# EAGLE design control_systemLayout (EAGLE 9.6.2)
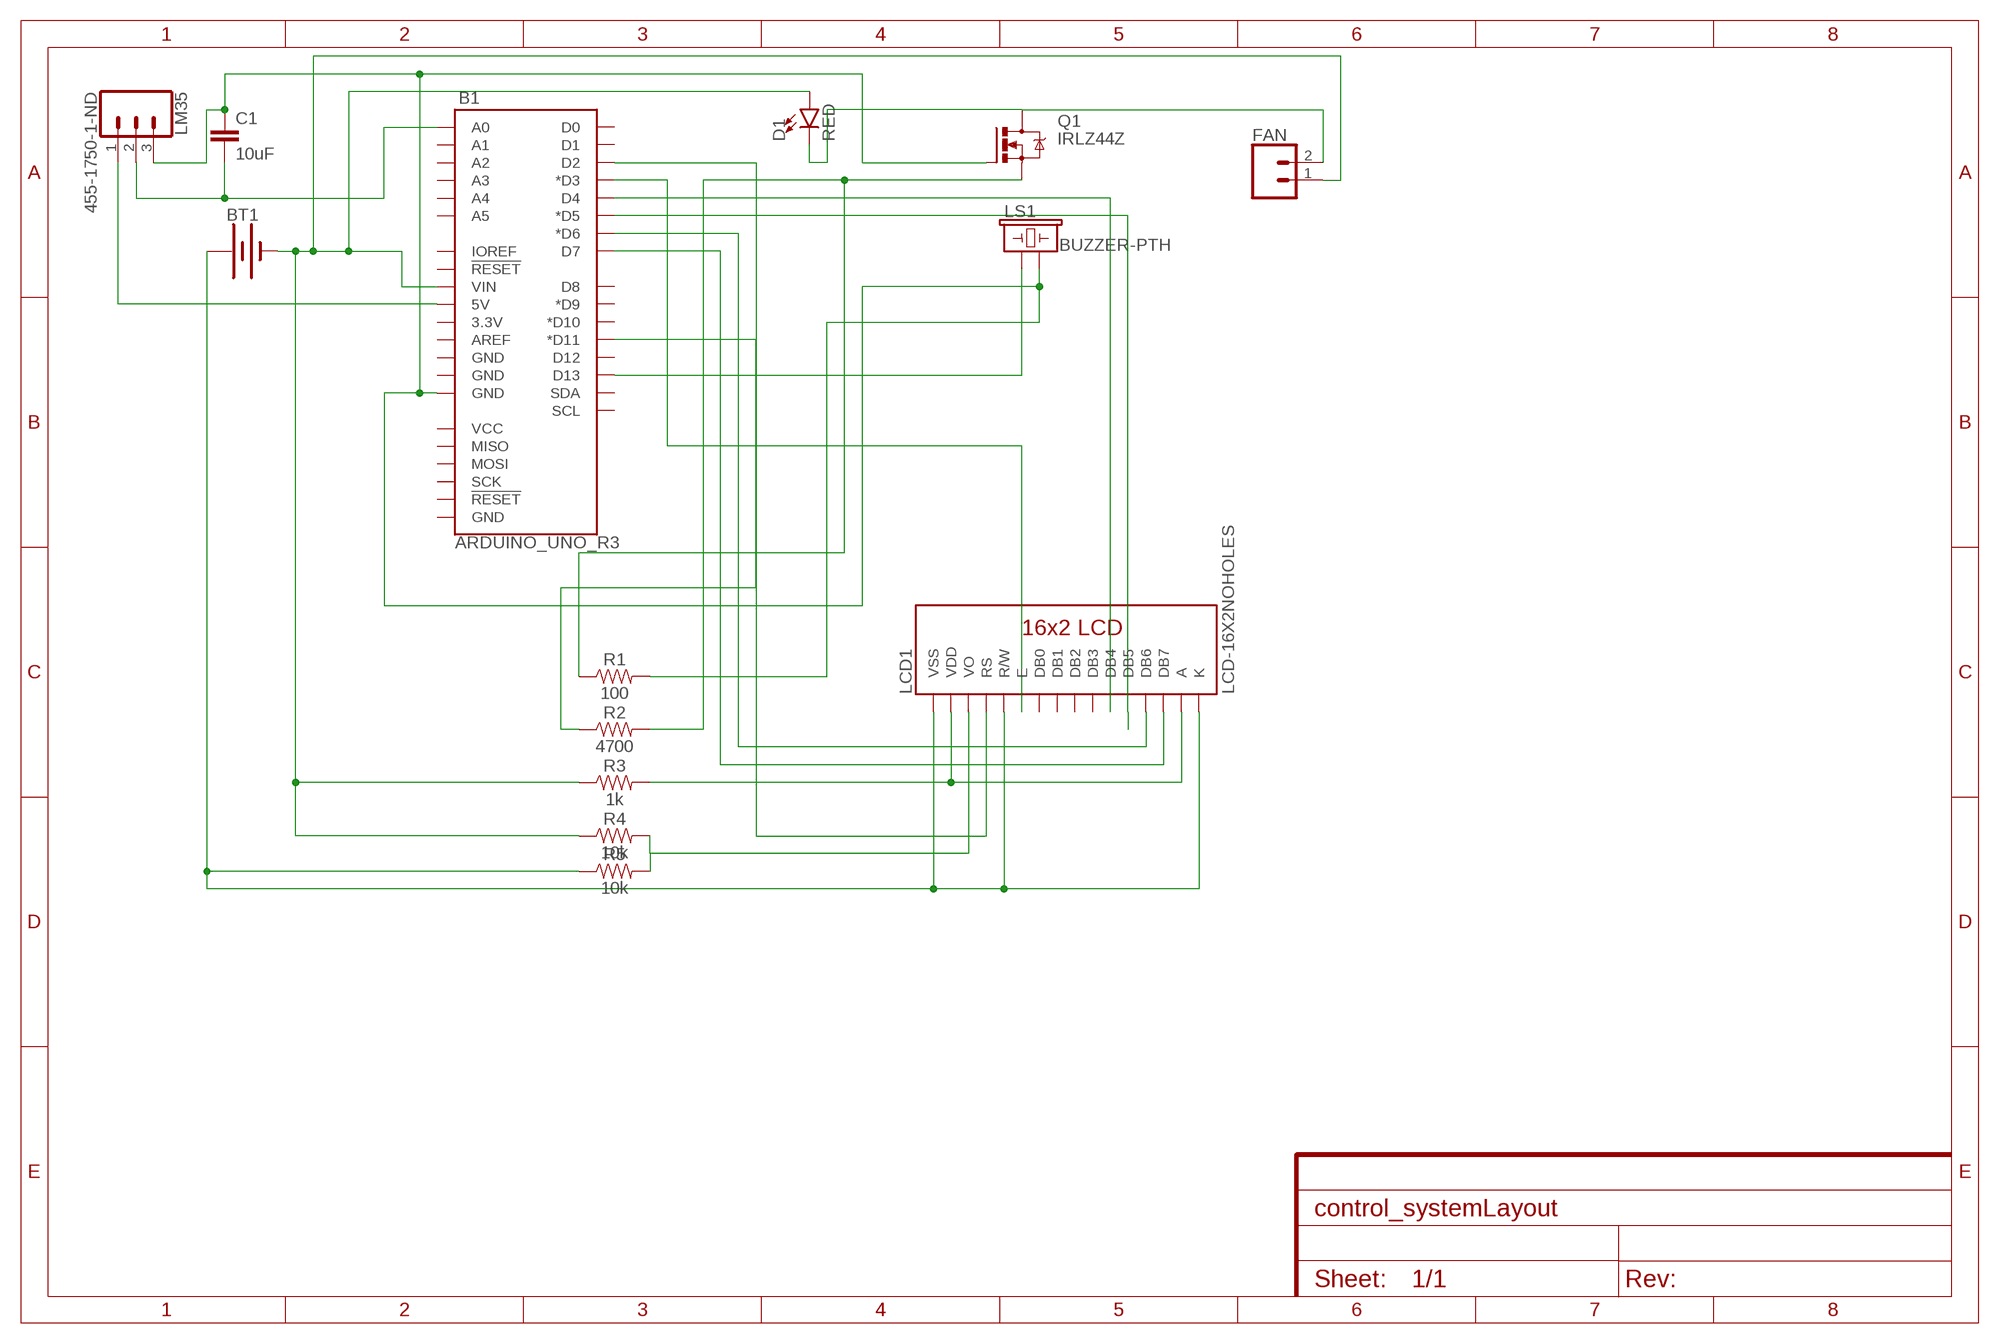
[diagram p0: schematic, sheet 1]

## Parts
B1  ARDUINO_UNO_R3  [ARDUINO_R3]
BT1  BATTERY-9V  [BATTCON_9V]
C1  10uF  0.18UF-0603-10V-10%  [0603]
D1  RED  LED-RED0603  [LED-0603]
FAN  CONN_02  [1X02]
LCD1  LCD-16X2NOHOLES  [LCD-16X2_NOHOLESNOSILK]
LM35  455-1750-1-ND  CONN_03  [1X03]
LS1  BUZZER-PTH  [BUZZER-12MM]
Q1  IRLZ44Z  [TO220BH]
R1  100  0.05OHM-0603-1/5W-1%  [0603]
R2  4700  0.05OHM-0603-1/5W-1%  [0603]
R3  1k  0.05OHM-0603-1/5W-1%  [0603]
R4  10k  0.05OHM-0603-1/5W-1%  [0603]
R5  10k  0.05OHM-0603-1/5W-1%  [0603]

## Nets
N$1: B1.VIN BT1.- D1.A FAN.1 R3.1 R4.1
N$2: B1.D13 LS1.+
N$3: Q1.S R1.1 R2.2
N$4: D1.C FAN.2 Q1.D
N$5: B1.D11(*D11) R2.1
N$6: LCD1.2(VDD) LCD1.15(A) R3.2
N$7: B1.GND@2(GND) C1.1 LM35.3 LS1.- Q1.G R1.2
N$8: B1.D7 LCD1.14(DB7)
N$9: BT1.+ LCD1.1(VSS) LCD1.5(R/W) LCD1.16(K) R5.1
N$10: B1.D6(*D6) LCD1.13(DB6)
N$11: B1.D5(*D5) LCD1.12(DB5)
N$12: B1.D4 LCD1.11(DB4)
N$13: B1.D3(*D3) LCD1.6(E)
N$14: B1.D2 LCD1.4(RS)
N$15: LCD1.3(VO) R4.2 R5.2
N$16: B1.5V LM35.1
N$17: B1.A0 C1.2 LM35.2
Unconnected: B1.3.3V B1.A1 B1.A2 B1.A3 B1.A4 B1.A5 B1.AREF B1.D0 B1.D1 B1.D8 B1.D9(*D9) B1.D10(*D10) B1.D12 B1.GND@1(GND) B1.GND@3(GND) B1.GND@4(GND) B1.IOREF B1.MISO B1.MOSI B1.RESET@1(!RESET!) B1.RESET@2(!RESET!) B1.SCK B1.SCL B1.SDA B1.VCC LCD1.7(DB0) LCD1.8(DB1) LCD1.9(DB2) LCD1.10(DB3)

## Library data of the parts
B1 = SparkFun-Boards:ARDUINO_UNO_R3: Arduino R3 Footprint with SPI header Arduino Uno R3 Compatible Footprint. Matches PCB size of the original board. SparkFun Products: SAMD21 Dev Breakout <https://www.sparkfun.com/products/13672> RedBoard <https://www.sparkfun.com/products/12757> R3 Stackable Headers <https://www.sparkfun.com/products/11417>
BT1 = SparkFun-Batteries:BATTERY: Battery - Single Cell A variety of battery chemistries, sizes, and footprints. Device List: 20MM_PTH - Coin Cell Battery Holder - 20mm (PTH) <https://www.sparkfun.com/products/783> 20MM_PTH_KIT- Coin Cell battery Holder - 20 mm (PTH) <http://www.sparkfun.com/products/783>kit version with special mask 6.8MM_PTH - Coin Cell Battery Holder - 6.8MM(SMD) <https://www.digikey.com/product-detail/en/seiko-instruments/MS621FE-FL11E/728-1057-ND/1889208?WT.srch=1&gclid=CNOQ5a6LzdQCFZS2wAodXCkE0g> 12MM_SMD - Coin Cell Battery Holder - 12mm (SMD) <https://www.sparkfun.com/products/10592> 12MM_PTH - Coin Cell Battery Holder - 12mm (PTH) <https://www.sparkfun.com/products/7948> 20MM_SMD - 20mm Coin Cell Battery Holder (SMD) (2 legs) Used on the Big Time Watch Kit <https://www.sparkfun.com/products/11734> 20MM_SMD_4LEGS - Coin Cell Battery Holder - 20mm (SMD) <https://www.sparkfun.com/products/11892> 20MM_SMD_4LEGS_OVERPASTE - Coin Cell Battery Holder - 20mm (SMD) <https://www.sparkfun.com/products/11892> (Over-paste on the legs) 24.5MM_PTH - Coin Cell Battery Holder - 24.5mm (PTH) <https://www.sparkfun.com/products/8863> 9V - 9V Battery Holder - PC Mount Used on the SparkFun SparkPunk Sound Kit <https://www.sparkfun.com/products/11177> and SparkFun SparkPunk Sequencer Kit <https://www.sparkfun.com/products/12707> 18650 - Battery Holder - 18650 (PTH) <https://www.sparkfun.com/products/13113> AA - Battery Holder - 1xAA (PTH) <https://www.sparkfun.com/products/7949> AAA - Battery Holder - 1xAAA (PTH) <https://www.sparkfun.com/products/12718> AA_KIT - Battery Holder - 1xAA (PTH) <https://www.sparkfun.com/products/7949> Special kit package - pads only have exposed copper on one side of the board. AAA_KIT - Battery Holder - 1xAAA (PTH) <https://www.sparkfun.com/products/12718> Special kit package - pads only have exposed copper on one side of the board.; PROD_ID: BATT-10855
C1 = SparkFun-Capacitors:0.18UF: 0.18µF ceramic capacitor A capacitor is a passive two-terminal electrical component used to store electrical energy temporarily in an electric field.; PROD_ID: CAP-12380; VALUE: 0.18uF
D1 = SparkFun-LED:LED-RED: Red SMD LED Used in manufacturing of most products at SparkFun Packages: 0603 - SMD 0603 package [Product Link] <http://docs.avagotech.com/docs/AV02-0551EN> 0603 SMART - SMD 0603 SMART package ( more efficient and expensive)[Product Link] <http://www.osram-os.com/Graphics/XPic2/00077099_0.pdf> 1206 - SMD1206 package [Product Link] <https://www.sparkfun.com/datasheets/DevTools/LilyPad/Q150OVS4.pdff> SparkFun Products: Pro Mini 328 -5V <https://www.sparkfun.com/products/821> RedBoard <https://www.sparkfun.com/products/12757> IOIO-OTG <https://www.sparkfun.com/products/13613>; PROD_ID: DIO-00819
FAN = SparkFun-Connectors:CONN_02: Multi connection point. Often used as Generic Header-pin footprint for 0.1 inch spaced/style header connections On any of the 0.1 inch spaced packages, you can populate with these: Break Away Headers - Straight <https://www.sparkfun.com/products/116> (PRT-00116) Break Away Male Headers - Right Angle <https://www.sparkfun.com/products/553> (PRT-00553) Female Headers <https://www.sparkfun.com/products/115> (PRT-00115) Break Away Headers - Machine Pin <https://www.sparkfun.com/products/117> (PRT-00117) Break Away Female Headers - Swiss Machine Pin <https://www.sparkfun.com/products/743> (PRT-00743) For SCREWTERMINALS and SPRING TERMINALS visit here: Screw Terimnals on SparkFun.com <https://www.sparkfun.com/search/results?term=Screw+Terminals> (5mm/3.5mm/2.54mm spacing) This device is also useful as a general connection point to wire up your design to another part of your project. Our various solder wires solder well into these plated through hole pads. Hook-Up Wire - Assortment (Stranded, 22 AWG) <https://www.sparkfun.com/products/11375> (PRT-11375) Hook-Up Wire - Assortment (Solid Core, 22 AWG) <https://www.sparkfun.com/products/11367> (PRT-11367) View the entire wire category on our website here <https://www.sparkfun.com/categories/141> Special notes: Molex polarized connector foot print use with: PRT-08233 with associated crimp pins and housings. 2.54_SCREWTERM for use with PRT-10571. 3.5mm Screw Terminal footprints for PRT-08084 5mm Screw Terminal footprints for use with PRT-08432
LCD1 = SparkFun-Displays:LCD-16X2: Standard text-only 16x2 parallel input LCD Basic 16 character by 2 line display. Typically utilizes the extremely common HD44780 parallel interface chipset SparkFun Products: Basic 16x2 Green <https://www.sparkfun.com/products/255> Basic 8x2 Green <https://www.sparkfun.com/products/11122>; SF_ID: LCD-00255
LM35 = SparkFun-Connectors:CONN_03: Multi connection point. Often used as Generic Header-pin footprint for 0.1 inch spaced/style header connections On any of the 0.1 inch spaced packages, you can populate with these: Break Away Headers - Straight <https://www.sparkfun.com/products/116> (PRT-00116) Break Away Male Headers - Right Angle <https://www.sparkfun.com/products/553> (PRT-00553) Female Headers <https://www.sparkfun.com/products/115> (PRT-00115) Break Away Headers - Machine Pin <https://www.sparkfun.com/products/117> (PRT-00117) Break Away Female Headers - Swiss Machine Pin <https://www.sparkfun.com/products/743> (PRT-00743) Stackable Header - 3 Pin (Female, 0.1") <https://www.sparkfun.com/products/13875> (PRT-13875) For SCREWTERMINALS and SPRING TERMINALS visit here: Screw Terimnals on SparkFun.com <https://www.sparkfun.com/search/results?term=Screw+Terminals> (5mm/3.5mm/2.54mm spacing) This device is also useful as a general connection point to wire up your design to another part of your project. Our various solder wires solder well into these plated through hole pads. Hook-Up Wire - Assortment (Stranded, 22 AWG) <https://www.sparkfun.com/products/11375> (PRT-11375) Hook-Up Wire - Assortment (Solid Core, 22 AWG) <https://www.sparkfun.com/products/11367> (PRT-11367) View the entire wire category on our website here <https://www.sparkfun.com/categories/141> Special notes: Molex polarized connector foot print use with SKU : PRT-08232 with associated crimp pins and housings.; PROD_ID: XXX-00000
LS1 = SparkFun-Electromechanical:BUZZER: Buzzer Small round buzzers that operate around the audible 2kHz range. You can use these as speakers to create simple music or user interfaces. Variant Overview: PTH - Mini Speaker - PC Mount 12mm 2.048kHz <https://www.sparkfun.com/products/7950> PTH_KIT - Mini Speaker - PC Mount 12mm 2.048kHz <https://www.sparkfun.com/products/7950> KIT simplifies soldering by adding stop mask to one side of the pads. PTH_NO_SILK - Mini Speaker - PC Mount 12mm 2.048kHz <https://www.sparkfun.com/products/7950> No silkscreen indicator of buzzer outline. PTH_KIT_NO_SILK - Mini Speaker - PC Mount 12mm 2.048kHz <https://www.sparkfun.com/products/7950> KIT package w/o silkscreen SMD - Buzzer Audio Magnetic (CCV-084B16) SMD buzzer used on, e.g. the LilyPad Buzzer <https://www.sparkfun.com/products/8463> and RFID USB Reader <https://www.sparkfun.com/products/9963>. SMD_KIT - Buzzer Audio Magnetic (CCV-084B16) SMD Buzzer with elongated pins to make soldering easier. Used on the SparkFun Simon Says - Surface Mount Soldering Kit <https://www.sparkfun.com/products/10935>.; PROD_ID: COMP-08253; SF_SKU: COM-07950
Q1 = transistor-power:IRLZ44Z: N-Channel HEXFET® Power MOSFET Logic Level AUTOMOTIVE MOSFET Source: http://www.irf.com/product-info/datasheets/data/irlz44zpbf.pdf
R1-R5 = SparkFun-Resistors:0.05OHM: 0.05Ω resistor A resistor is a passive two-terminal electrical component that implements electrical resistance as a circuit element. Resistors act to reduce current flow, and, at the same time, act to lower voltage levels within circuits. - Wikipedia; PROD_ID: RES-12535; VALUE: 0.05

## Board
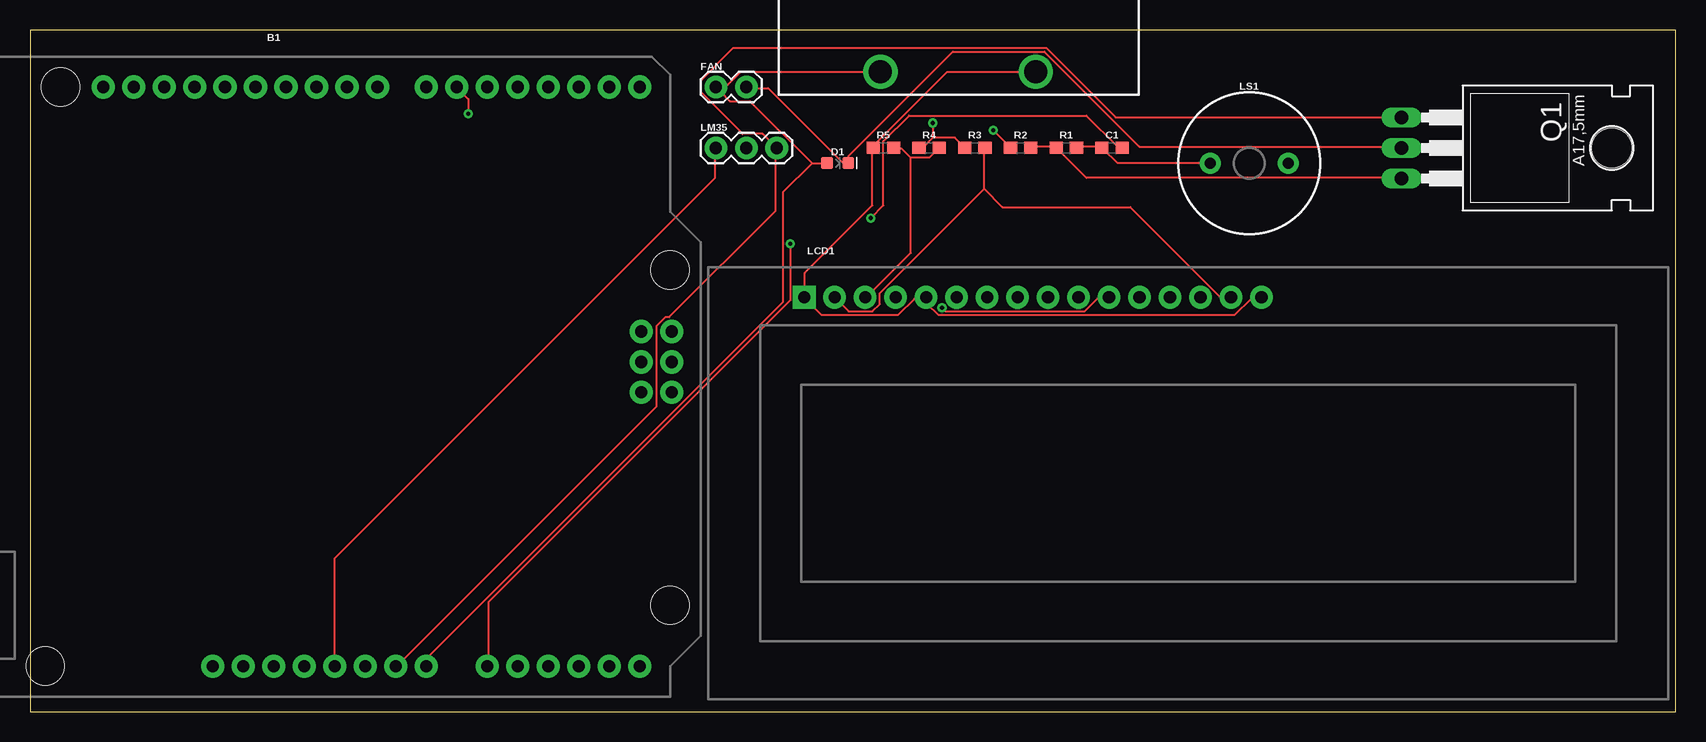
[diagram p1: board, top side]
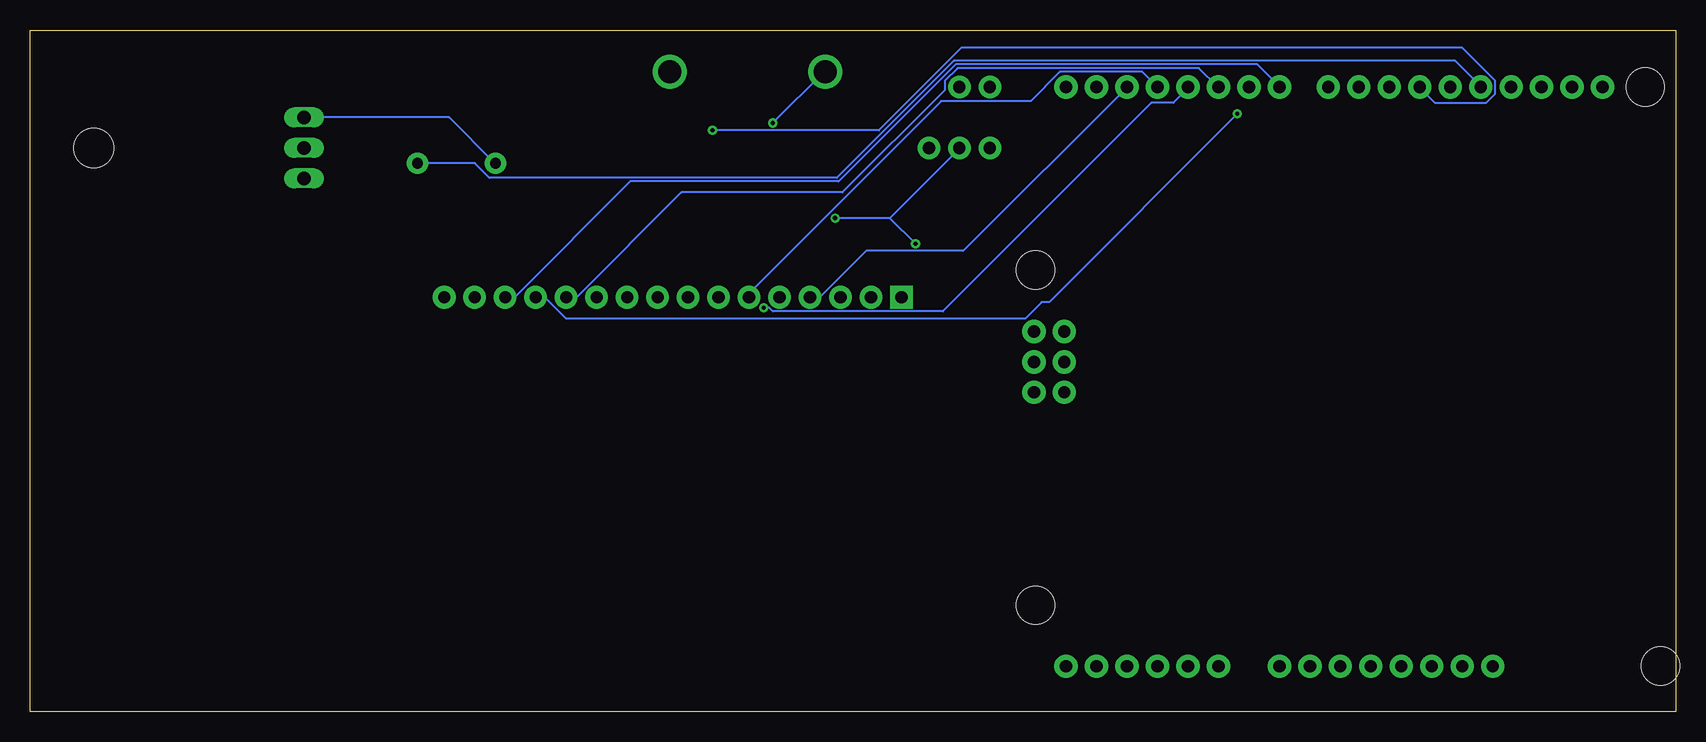
[diagram p2: board, bottom side, seen from below]

Size 137.14 x 56.82 mm. Coordinates in mm from the lower left corner, seen from the top.
Outline: 0,0 137.14,0 137.14,56.82 0,56.82 0,0
Copper layers (1*16): Top 0.035mm / dielectric 1.5mm / Bottom 0.035mm
Design rules "default": minimum track width 6mil, minimum drill 0.35mm, track to track 6mil, track to pad 6mil, pad to pad 6mil, via to via 6mil, smd to smd 6mil, copper to edge 40mil, drill to drill 6mil, minimum pad ring 10mil, minimum via ring 8mil, stop-mask expansion 4mil, vias tented up to drill 0mil, thermal gap 10mil

### Footprints (pad centres in the part's own frame; a part is rotated, then mirrored left to right if it is on the bottom)
ARDUINO_R3 = drill 1.016 pad 1.93: 3.3V 2.54,-24.13; 5V 5.08,-24.13; A0 17.78,-24.13; A1 20.32,-24.13; A2 22.86,-24.13; A3 25.4,-24.13; A4 27.94,-24.13; A5 30.48,-24.13; AREF -9.144,24.13; D0 30.48,24.13; D1 27.94,24.13; D2 25.4,24.13; D3 22.86,24.13; D4 20.32,24.13; D5 17.78,24.13; D6 15.24,24.13; D7 12.7,24.13; D8 8.636,24.13; D9 6.096,24.13; D10 3.556,24.13; D11 1.016,24.13; D12 -1.524,24.13; D13 -4.064,24.13; GND@1 7.62,-24.13; GND@2 10.16,-24.13; GND@3 -6.604,24.13; GND@4 33.16,-1.32; IOREF -2.54,-24.13; MISO 30.62,3.76; MOSI 33.16,1.22; NC -5.08,-24.13; RESET@1 0,-24.13; RESET@2 30.62,-1.32; SCK 30.62,1.22; SCL -14.224,24.13; SDA -11.684,24.13; VCC 33.16,3.76; VIN 12.7,-24.13 | hole 3.175: -17.78,24.13; 33.02,8.89; 33.02,-19.05; -19.05,-24.13
BATTCON_9V = drill 1.905: + 0,0; - 0,-12.954
0603 = smd 1.1 x 1: 1 -0.85,0; 2 0.85,0
LED-0603 = smd 1 x 1: A -0.877,0; C 0.877,0
1X02 = drill 1.016 pad 1.88: 1 0,0; 2 2.54,0
LCD-16X2_NOHOLESNOSILK = drill 1.016 pad 1.88 square: 1 -32,15.5 | drill 1.016 pad 1.88: 2 -29.46,15.5; 3 -26.92,15.5; 4 -24.38,15.5; 5 -21.84,15.5; 6 -19.3,15.5; 7 -16.76,15.5; 8 -14.22,15.5; 9 -11.68,15.5; 10 -9.14,15.5; 11 -6.6,15.5; 12 -4.06,15.5; 13 -1.52,15.5; 14 1.02,15.5; 15 3.56,15.5; 16 6.1,15.5
1X03 = drill 1.016 pad 1.88: 1 0,0; 2 2.54,0; 3 5.08,0
BUZZER-12MM = drill 0.9 pad 1.778: + 3.25,0; - -3.25,0
TO220BH = drill 1.118 long: D 0,-6.35; G -2.54,-6.35; S 2.54,-6.35 | hole 3.302: 0,11.176

### Placement (x,y rotation side)
B1  20.32,27.94 0 top
BT1  83.82,53.34 270 top
C1  90.17,46.99 0 top
D1  67.31,45.72 0 top
FAN  57.15,52.07 0 top
LCD1  96.52,19.05 0 top
LM35  57.15,46.99 0 top
LS1  101.6,45.72 0 top
Q1  120.65,46.99 270 top
R1  86.36,46.99 0 top
R2  82.55,46.99 0 top
R3  78.74,46.99 0 top
R4  74.93,46.99 0 top
R5  71.12,46.99 0 top

### Tracks (layer width: path | path; a pad name or v marks a point on that pad's centre or on a via)
N$1  (via drill 0.35)
  Top 0.152: 75.23,47.85 74.47,47.09 74.17,47.09 R4.1 | 75.23,47.85 77.06,47.85 77.83,47.09 R3.1 | v75.23,49.07 75.23,47.85 | 65.18,45.72 D1.A | 65.18,45.72 59.99,50.9 58.32,50.9 57.56,51.66 | 57.56,51.66 FAN.1 57.25,51.97 | B1.VIN 33.02,4.42 62.74,34.14 62.74,43.28 65.18,45.72 | BT1.- 59.23,53.34 57.56,51.66
  Bottom 0.152: v75.23,49.07 70.97,53.34 BT1.-
N$2
  Bottom 0.152: LS1.+ 100.08,45.72 98.86,44.5 69.9,44.5 60.15,54.25 18.39,54.25 16.26,52.12 B1.D13
N$3
  Top 0.152: R2.2 83.46,47.09 85.45,47.09 R1.1 85.6,46.94 88.04,44.5 114.25,44.5 Q1.S
N$4
  Top 0.152: FAN.2 59.69,51.97 61.52,51.97 67.77,45.72 D1.C 68.22,45.72 68.22,46.33 76.91,55.02 84.53,55.02 92.46,47.09 114.25,47.09 Q1.D
N$5  (via drill 0.35)
  Top 0.152: v80.26,48.46 81.64,47.09 R2.1
  Bottom 0.152: v80.26,48.46 66.4,48.46 59.54,55.32 17.78,55.32 15.04,52.58 15.04,51.51 15.8,50.75 20.07,50.75 21.29,51.97 B1.D11
N$6
  Top 0.152: 79.5,43.59 79.5,46.94 R3.2 | 79.5,43.59 70.81,34.9 70.81,33.98 70.21,33.38 68.22,33.38 67.16,34.44 LCD1.2 | 79.5,43.59 81.03,42.06 91.69,42.06 99.16,34.59 100.08,34.59 LCD1.15
N$7
  Top 0.152: R1.2 87.27,47.09 89.26,47.09 C1.1 89.41,46.94 90.63,45.72 LS1.- | B1.GND@2 30.58,3.81 52.22,25.45 52.22,32.16 52.98,32.92 53.29,32.92 62.13,41.76 62.13,46.94 LM35.3 61.06,48.16 59.38,48.16 55.88,51.66 55.88,52.58 58.62,55.32 84.68,55.32 90.48,49.53 Q1.G
  Bottom 0.152: Q1.G 102.21,49.53 98.4,45.72 LS1.-
N$8
  Bottom 0.152: LCD1.14 97.48,34.59 96.72,34.59 87.12,44.2 69.75,44.2 59.99,53.95 34.85,53.95 33.02,52.12 B1.D7
N$9
  Top 0.152: LCD1.16 102.51,34.44 101.75,34.44 100.38,33.07 75.69,33.07 74.78,33.98 74.78,34.44 LCD1.5 74.62,34.44 73.71,34.44 72.34,33.07 65.94,33.07 64.57,34.44 LCD1.1 64.57,34.59 64.57,36.58 70.21,42.22 70.21,46.94 R5.1 70.21,47.09 76.45,53.34 BT1.+
N$10  (via drill 0.35)
  Top 0.152: v36.52,49.84 36.52,51.05 35.61,51.97 B1.D6
  Bottom 0.152: v36.52,49.84 52.22,34.14 52.83,34.14 54.2,32.77 92.46,32.77 94.13,34.44 94.89,34.44 LCD1.13
N$11
  Bottom 0.152: LCD1.12 92.46,34.59 91.54,34.59 82.86,43.28 69.44,43.28 60.91,51.82 60.91,52.58 59.84,53.65 39.73,53.65 38.2,52.12 B1.D5
N$12  (via drill 0.35)
  Top 0.152: v76,33.68 76.3,33.38 87.88,33.38 88.95,34.44 89.87,34.44 LCD1.11
  Bottom 0.152: v76,33.68 75.54,33.68 75.23,33.38 61.06,33.38 43.69,50.75 41.86,50.75 40.64,51.97 B1.D4
N$13
  Bottom 0.152: B1.D3 44.45,53.34 51.31,53.34 53.75,50.9 61.21,50.9 77.22,34.9 77.22,34.59 LCD1.6
N$14
  Bottom 0.152: B1.D2 59.38,38.41 67.46,38.41 71.27,34.59 72.03,34.59 LCD1.4
N$15
  Top 0.152: 73.41,46.18 72.64,46.94 72.03,46.94 R5.2 | 73.41,46.18 74.93,46.18 75.69,46.94 R4.2 | 73.41,46.18 73.41,38.25 69.75,34.59 LCD1.3
N$16
  Top 0.152: B1.5V 25.4,12.8 57.1,44.5 57.1,46.94 LM35.1
N$17  (via drill 0.35)
  Top 0.152: v70.05,41.15 71.12,42.22 71.12,47.55 73.25,49.68 88.04,49.68 90.63,47.09 90.93,47.09 C1.2 | v63.35,39.01 63.35,34.29 38.2,9.14 38.2,3.81 B1.A0
  Bottom 0.152: 65.48,41.15 v70.05,41.15 | 65.48,41.15 59.69,46.94 LM35.2 | 65.48,41.15 v63.35,39.01